# Altium schematic sheet VapeixS.SchDoc: Vapeix Shield 1.0
size A2; CheckedBy: q; DrawnBy: Anne Moller; Engineer: Anne Moller; DocumentNumber: 1; Revision: 1.0.0; SheetNumber: 1; SheetTotal: 1; Project Number: 1; DocumentName: Anne Moller; ProjectName: Vapeix Shield
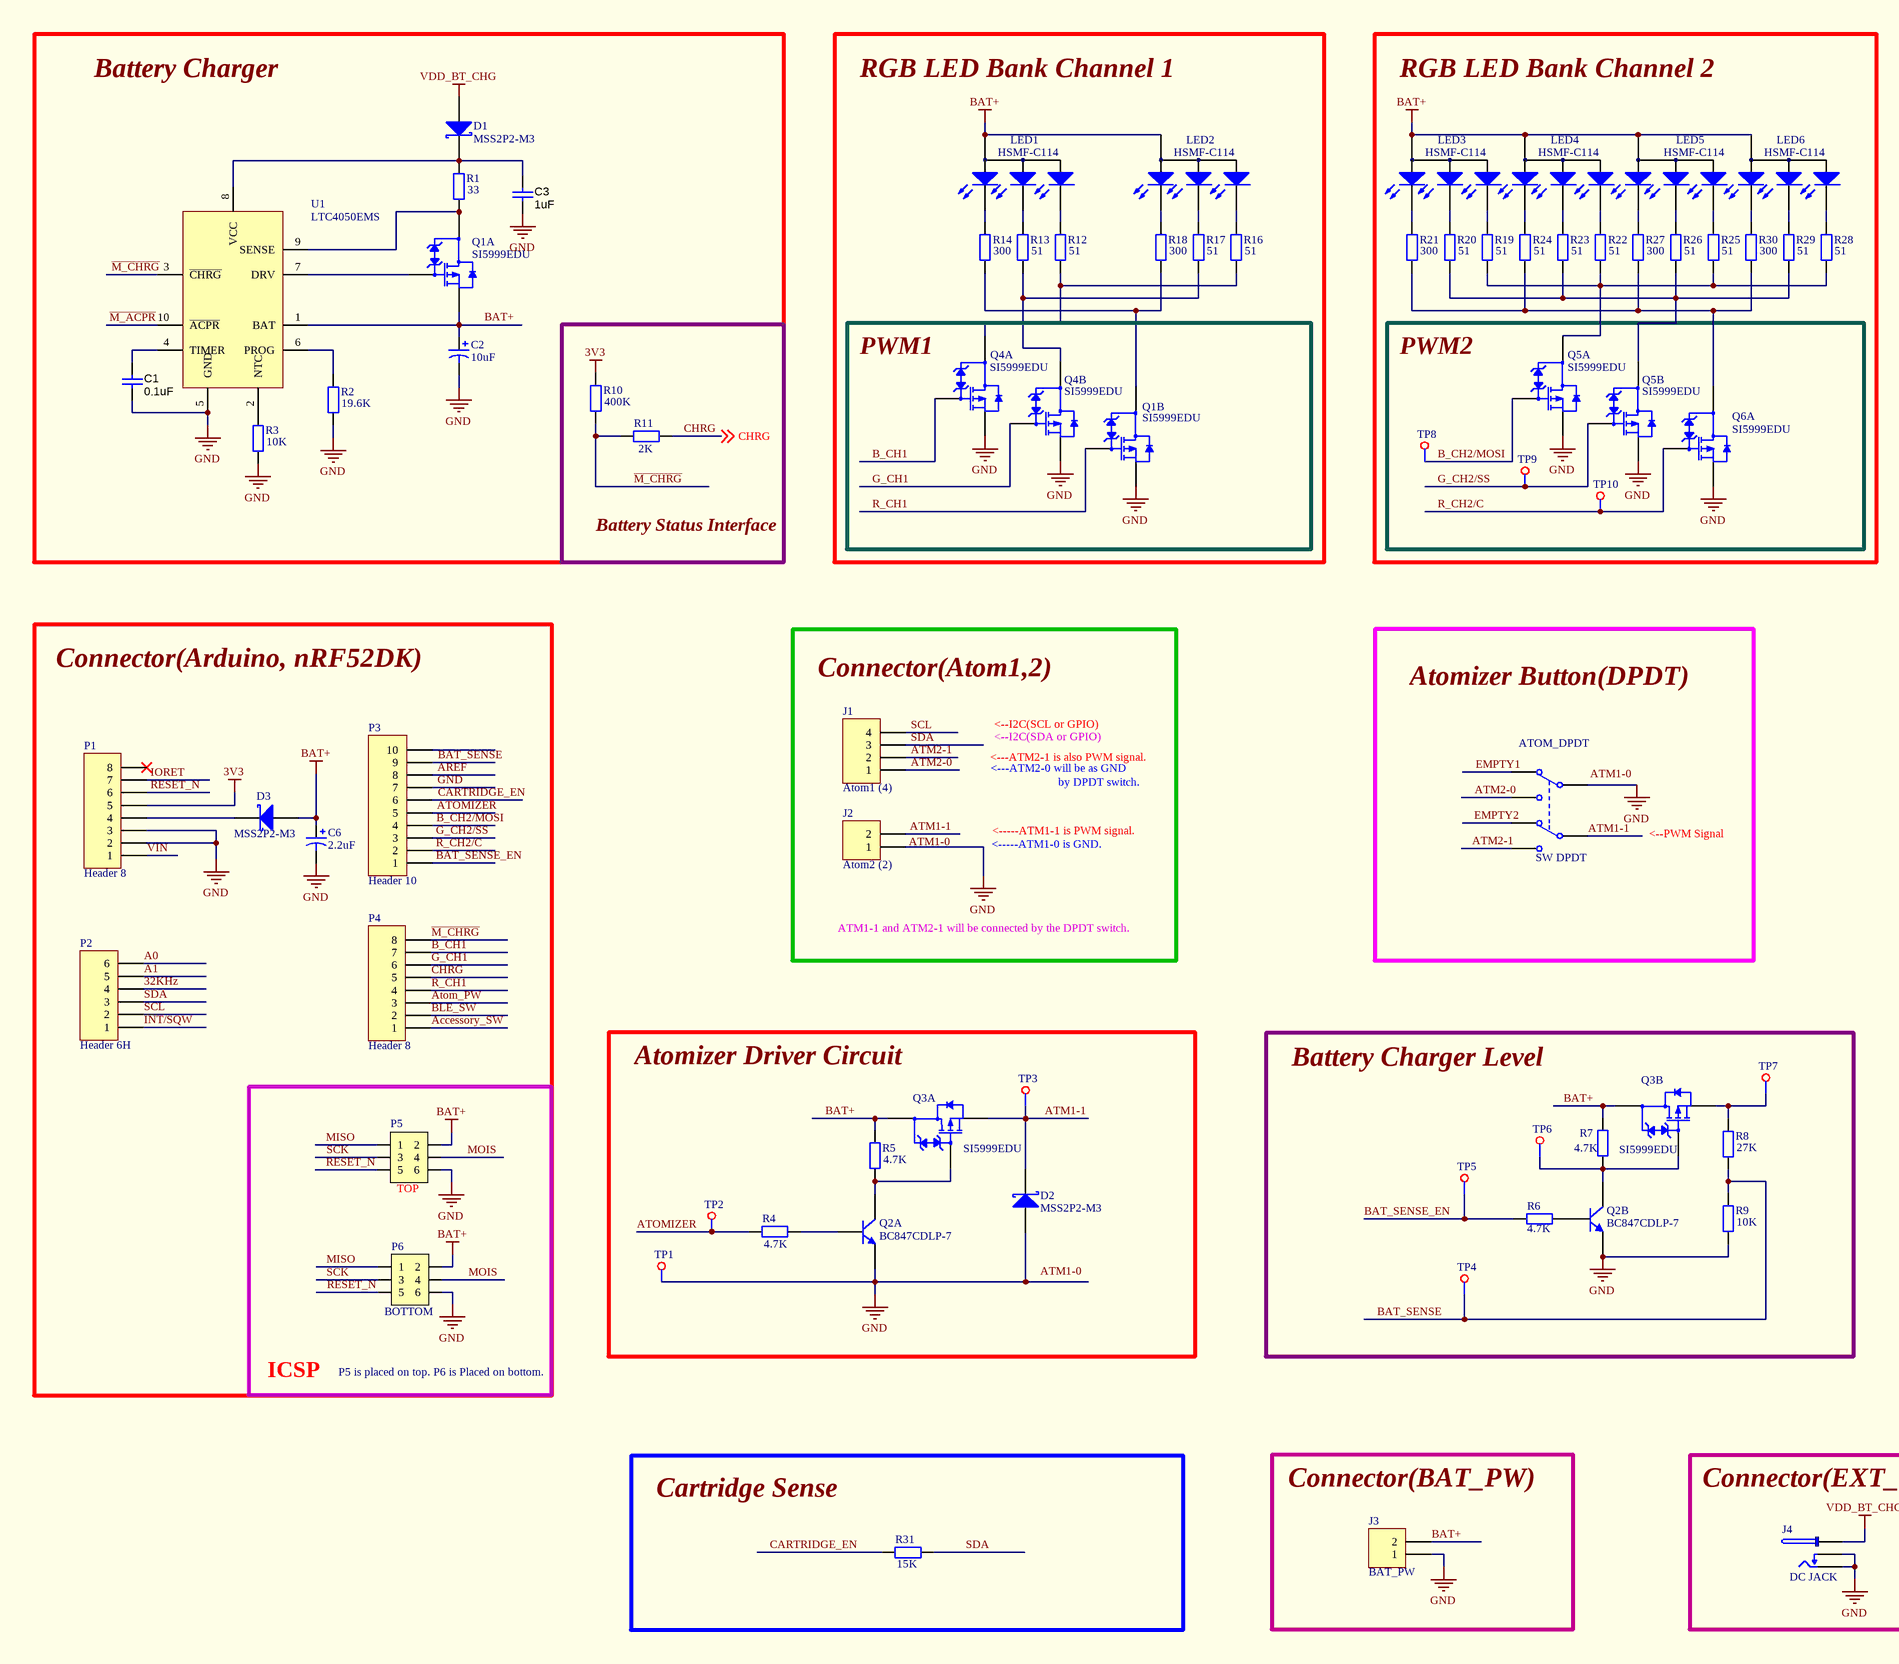
[diagram p0: VapeixS.SchDoc, left]
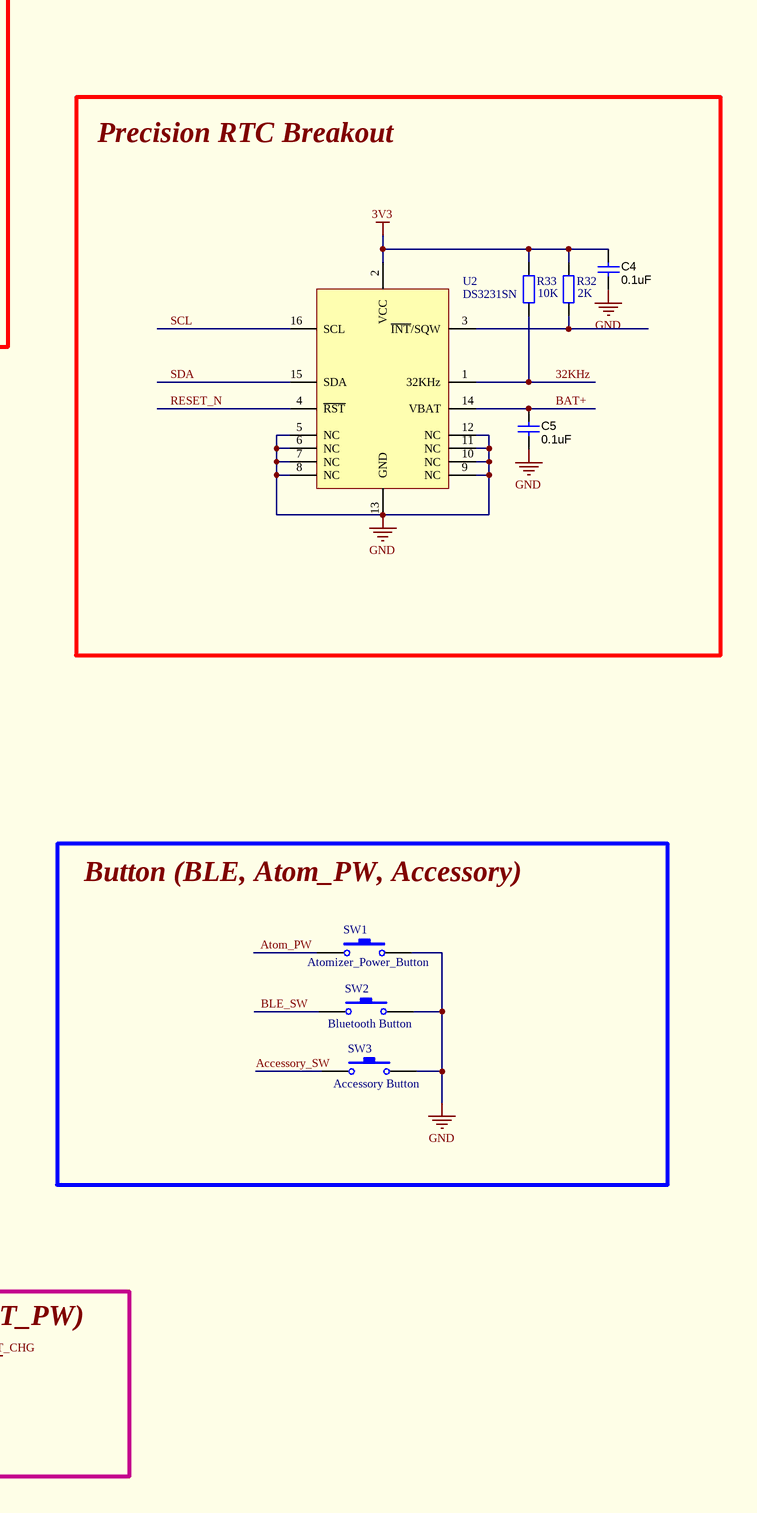
[diagram p1: VapeixS.SchDoc, right]

## Parts
ATOM_DPDT  SW DPDT  [JS202011SCQN]
C1  ValueDisplayed: 0.1uF  [CAPC1608X06L]
C2  value 10uF  [C0805]  (hidden comment: Cap Pol3)
C3  ValueDisplayed: 1uF  [CAPC1608X06L]
C4  ValueDisplayed: 0.1uF  [CAPC1608X06L]
C5  ValueDisplayed: 0.1uF  [CAPC1608X06L]
C6  value 2.2uF  [C0805]  (hidden comment: Cap Pol3)
D1  MSS2P2-M3  [MSS2P2-M3]
D2  MSS2P2-M3  [MSS2P2-M3]
D3  MSS2P2-M3  [MSS2P2-M3]
J1  Atom1 (4)  [S4B-PH-K-S]
J2  Atom2 (2)  [S2B-PH-K-S]
J3  BAT_PW  [S2B-PH-K-S]
J4  DC JACK  [DC POWER JACK]
LED1  HSMF-C114  [HSMF-C114]
LED2  HSMF-C114  [HSMF-C114]
LED3  HSMF-C114  [HSMF-C114]
LED4  HSMF-C114  [HSMF-C114]
LED5  HSMF-C114  [HSMF-C114]
LED6  HSMF-C114  [HSMF-C114]
P1  Header 8  [LS-00008]
P2  Header 6H  [LS-00007]
P3  Header 10  [LS-00009]
P4  Header 8  [LS-00008]
P5  TOP  [Molex 15-91-2060]
P6  BOTTOM  [CLH-103-F-D-BE-K-TR]
Q1  SI5999EDU  [SI5999EDU]  (parts A,B of 2)
Q2  BC847CDLP-7  [BC847CDLP-7]  (parts A,B of 2)
Q3  SI5999EDU  [SI5999EDU]  (parts A,B of 2)
Q4  SI5999EDU  [SI5999EDU]  (parts A,B of 2)
Q5  SI5999EDU  [SI5999EDU]  (parts A,B of 2)
Q6  SI5999EDU  [SI5999EDU]  (part A of 2)
R1  value 33  [INDC1608X06L]
R2  value 19.6K  [INDC1608X06L]
R3  value 10K  [INDC1608X06L]
R4  value 4.7K  [INDC1608X06L]
R5  value 4.7K  [INDC1608X06L]
R6  value 4.7K  [INDC1608X06L]
R7  value 4.7K  [INDC1608X06L]
R8  value 27K  [INDC1608X06L]
R9  value 10K  [INDC1608X06L]
R10  value 400K  [INDC1608X06L]
R11  value 2K  [INDC1608X06L]
R12  value 51  [INDC1608X06L]
R13  value 51  [INDC1608X06L]
R14  value 300  [INDC1608X06L]
R16  value 51  [INDC1608X06L]
R17  value 51  [INDC1608X06L]
R18  value 300  [INDC1608X06L]
R19  value 51  [INDC1608X06L]
R20  value 51  [INDC1608X06L]
R21  value 300  [INDC1608X06L]
R22  value 51  [INDC1608X06L]
R23  value 51  [INDC1608X06L]
R24  value 51  [INDC1608X06L]
R25  value 51  [INDC1608X06L]
R26  value 51  [INDC1608X06L]
R27  value 300  [INDC1608X06L]
R28  value 51  [INDC1608X06L]
R29  value 51  [INDC1608X06L]
R30  value 300  [INDC1608X06L]
R31  value 15K  [INDC1608X06L]
R32  value 2K  [INDC1608X06L]
R33  value 10K  [INDC1608X06L]
SW1  Atomizer_Power_Button  [PTS645SH50SMTR92]
SW2  Bluetooth Button  [PTS645SH50SMTR92]
SW3  Accessory Button  [PTS645SH50SMTR92]
TP1  TP  [TP]  (value not drawn)
TP2  TP  [TP]  (value not drawn)
TP3  TP  [TP]  (value not drawn)
TP4  TP  [TP]  (value not drawn)
TP5  TP  [TP]  (value not drawn)
TP6  TP  [TP]  (value not drawn)
TP7  TP  [TP]  (value not drawn)
TP8  TP  [TP]  (value not drawn)
TP9  TP  [TP]  (value not drawn)
TP10  TP  [TP]  (value not drawn)
U1  LTC4050EMS  [LTC4050EMS]
U2  DS3231SN  [DS3231SN]

## Nets
3V3: C4.1 P1.5 R10.1 R32.1 R33.1 U2.2(VCC)
BAT+: C2.1 C5.1 C6.1 D3.1(A) J3.2 LED1.1(ANODE) LED2.1(ANODE) LED3.1(ANODE) LED4.1(ANODE) LED5.1(ANODE) LED6.1(ANODE) P5.2 P6.2 Q1.7(D1) Q3.1(S1) Q3.3(S2) R5.1 R7.1 U1.1(BAT) U2.14(VBAT)
GND: ATOM_DPDT.2(COMMON1) C1.2 C2.2 C3.2 C4.2 C5.2 C6.2 D2.1(A) J2.1 J3.1 J4.2 J4.3 P1.2 P1.3 P3.7 P5.6 P6.6 Q1.5(D2) Q2.1(E1) Q2.4(E2) Q4.5(D2) Q4.7(D1) Q5.5(D2) Q5.7(D1) Q6.7(D1) R2.2 R3.2 R9.2 SW1.2 SW2.2 SW3.2 TP1.1(TP) U1.5(GND) U2.5(NC) U2.6(NC) U2.7(NC) U2.8(NC) U2.9(NC) U2.10(NC) U2.11(NC) U2.12(NC) U2.13(GND)
VDD_BT_CHG: D1.1(A) J4.1
32KHz: P2.4 R33.2 U2.1(32KHz)
A0: P2.6
A1: P2.5
Accessory_SW: P4.1 SW3.1
AREF: P3.8
ATM1-1: ATOM_DPDT.5(COMMON2) D2.2(K) J2.2 Q3.7(D1) TP3.1(TP)
ATM2-0: ATOM_DPDT.3(NO1) J1.1
ATM2-1: ATOM_DPDT.6(NO2) J1.2
Atom_PW: P4.3 SW1.1
ATOMIZER: P3.5 R4.1 TP2.1(TP)
B_CH1: P4.7 Q4.2(G1)
B_CH2/MOSI: P3.4 Q5.2(G1) TP8.1(TP)
BAT_SENSE: P3.9 R8.2 R9.1 TP4.1(TP)
BAT_SENSE_EN: P3.1 R6.1 TP5.1(TP)
BLE_SW: P4.2 SW2.1
CARTRIDGE_EN: P3.6 R31.1
CHRG: P4.5 R11.2 ; off-sheet CHRG
EMPTY1: ATOM_DPDT.1(NC1)
EMPTY2: ATOM_DPDT.4(NC2)
G_CH1: P4.6 Q4.4(G2)
G_CH2/SS: P3.3 Q5.4(G2) TP9.1(TP)
~{INT}/SQW: P2.1
IORET: P1.7
~{M_ACPR}: U1.10(~{ACPR})
~{M_CHRG}: P4.8 R10.2 R11.1 U1.3(~{CHRG})
MISO: P5.1 P6.1
MOIS: P5.4 P6.4
R_CH1: P4.4 Q1.4(G2)
R_CH2/C: P3.2 Q6.2(G1) TP10.1(TP)
RESET_N: P1.6 P5.5 P6.5 U2.4(~{RST})
SCK: P5.3 P6.3
SCL: J1.4 P2.2 U2.16(SCL)
SDA: J1.3 P2.3 R31.2 U2.15(SDA)
VIN: P1.1
NetC1_1: C1.1 U1.4(TIMER)
NetC3_1: C3.1 D1.2(K) R1.1 U1.8(VCC)
NetD3_2: D3.2(K) P1.4
NetLED1_2: LED1.2(RED) R14.1
NetLED1_3: LED1.3(GREEN) R13.1
NetLED1_4: LED1.4(BLUE) R12.1
NetLED2_2: LED2.2(RED) R18.1
NetLED2_3: LED2.3(GREEN) R17.1
NetLED2_4: LED2.4(BLUE) R16.1
NetLED3_2: LED3.2(RED) R21.1
NetLED3_3: LED3.3(GREEN) R20.1
NetLED3_4: LED3.4(BLUE) R19.1
NetLED4_2: LED4.2(RED) R24.1
NetLED4_3: LED4.3(GREEN) R23.1
NetLED4_4: LED4.4(BLUE) R22.1
NetLED5_2: LED5.2(RED) R27.1
NetLED5_3: LED5.3(GREEN) R26.1
NetLED5_4: LED5.4(BLUE) R25.1
NetLED6_2: LED6.2(RED) R30.1
NetLED6_3: LED6.3(GREEN) R29.1
NetLED6_4: LED6.4(BLUE) R28.1
NetQ1_1: Q1.1(S1) R1.2 U1.9(SENSE)
NetQ1_2: Q1.2(G1) U1.7(DRV)
NetQ1_3: Q1.3(S2) R14.2 R18.2
NetQ2_2: Q2.2(B1) R4.2
NetQ2_3: Q2.3(C1) Q3.2(G1) R5.2
NetQ2_5: Q2.5(B2) R6.2
NetQ2_6: Q2.6(C2) Q3.4(G2) R7.2 TP6.1(TP)
NetQ3_5: Q3.5(D2) R8.1 TP7.1(TP)
NetQ4_1: Q4.1(S1) R12.2 R16.2
NetQ4_3: Q4.3(S2) R13.2 R17.2
NetQ5_1: Q5.1(S1) R19.2 R22.2 R25.2 R28.2
NetQ5_3: Q5.3(S2) R20.2 R23.2 R26.2 R29.2
NetQ6_1: Q6.1(S1) R21.2 R24.2 R27.2 R30.2
NetR2_1: R2.1 U1.6(PROG)
NetR3_1: R3.1 U1.2(NTC)
NetR32_2: R32.2 U2.3(~{INT}/SQW)

Not connected (* = marked no-connect by the designer): P1 8*; P3 10

## Notes on the sheet
- Labels drawn without touching a wire or pin: <-----ATM1-0 is GND., <-----ATM1-1 is PWM signal., <---ATM2-0 will be as GND, <---ATM2-1 is also PWM signal., <--I2C(SCL or GPIO), <--I2C(SDA or GPIO), <--PWM Signal, ATM1-0, ATM1-1 and ATM2-1 will be connected by the DPDT switch., Atomizer Button(DPDT), Atomizer Driver Circuit, Battery Charger, Battery Charger Level, Battery Status Interface, Button (BLE, Atom_PW, Accessory), by DPDT switch., Cartridge Sense, Connector(Arduino, nRF52DK), Connector(Atom1,2), Connector(BAT_PW), Connector(EXT_PW), ICSP, P5 is placed on top. P6 is Placed on bottom., Precision RTC Breakout, PWM1, PWM2, RGB LED Bank Channel 1, RGB LED Bank Channel 2
- Title
- Date:
- File:
- Size
- A2
- Project Number
- Sheet
- Drawn by :
- Revision
- of

## Library data of the parts
ATOM_DPDT = JS202011SCQN: SWITCH SLIDE DPDT 300MA 6V; Manufacturer: C&K Components; Contact Timing: Not Specified; Switch Function: On-On; Current Rating: 300mA (DC); Actuator Type: Standard; Actuator Length: 2.00mm; Actuator Material: Polyamide (PA46), Nylon 4/6; Electrical Life: 5,000 Cycles; Supplier 1: Digi-Key; Manufacturer Part Number: JS202011SCQN; RoHS: RoHS Compliant; Category: Switches; Stock 1: 26140; Pricing 1: 1=0.46, 10=0.441, 25=0.4316, 50=0.3858, 100=0.3674, 250=0.3582, 500=0.3031 (USD); Packaging: Cut Tape (CT); Circuit: DPDT; Voltage Rating - AC: -; Voltage Rating - DC: 6V; Contact Material: Copper Alloy; Contact Finish: Silver; Mounting Type: Surface Mount; Termination Style: Gull Wing; Features: -; Switch Travel: 2.00mm; Operating Temperature: -40°C ~ 85°C; Mechanical Life: -; Operating Force: -; ComponentLink1URL: http://www.ck-components.com/14398/js_7jan16.pdf/; ComponentLink1Description: http://www.ck-components.com/14398/js_7jan16.pdf/
C1 C3-C5 = GRM219R61A106KE44D: CAP, CERM, 10 µF, 10 V, +/- 10%, X5R, 0805; Manufacturer: MuRata; Polarized: N; CompType: Capacitor; Value: 10uF; U/M: EA; Cap_F: 0.00001; Tolerance_%: 10; ESR_ohm: 0.005; Value1: 0.005 ohm; Value2: 10V; TaMin_C: -55; TaMax_C: 85; Cap_Case: 0805; SymbolVersion: 2008-07-09; PartNumber: GRM219R61A106KE44D; PackageReference: 0805; RoHS: Y; VDC_V: 10; MountType: SMT; Technology: Ceramic; TempCo: X5R; Published: 2008-06-19; Publisher: Texas Instruments; LatestRevisionDate: 2014-08-19; ComponentLink1Description: Datasheet link; ComponentLink1URL: http://psearch.murata.com/capacitor/product/GRM219R61A106KE44%23.pdf; Supplier 1: Digi-Key; Supplier Part Number 1: 490-4735-1-ND; Supplier 2: Mouser; Supplier Part Number 2: 81-GRM219R61A106KE4D; Supplier 3: Farnell; Supplier Part Number 3: 1845741
C2 C6 = Cap Pol3: Polarized Capacitor (Surface Mount); Published: 8-Jun-2000; LatestRevisionDate: 29-May-2009; LatestRevisionNote: IPC-7351 Footprint Added.; PackageReference: C0805; Publisher: Altium Limited; PackageDescription: Chip Capacitor
D1-D3 = MSS2P2-M3/89A: DIODE SCHOTTKY 20V 2A MICROSMP; Manufacturer: Vishay Semiconductor Diodes Division; Voltage - Forward (Vf) (Max) @ If: 600mV @ 2A; Speed: Fast Recovery =< 500ns, > 200mA (Io); Current - Reverse Leakage @ Vr: 250µA @ 20V; Capacitance @ Vr, F: 65pF @ 4V, 1MHz; Supplier 1: Digi-Key; Manufacturer Part Number: MSS2P2-M3/89A; RoHS: RoHS Compliant; Category: Discrete Semiconductor Products; Stock 1: 3961; Pricing 1: 1=0.37, 10=0.274, 100=0.1552, 500=0.1029, 1000=0.07892 (USD); Packaging: Digi-Reel®; Diode Type: Schottky; Voltage - DC Reverse (Vr) (Max): 20V; Current - Average Rectified (Io): 2A; Reverse Recovery Time (trr): -; Mounting Type: Surface Mount; Package / Case: MicroSMP; Supplier Device Package: MicroSMP; Operating Temperature - Junction: -55°C ~ 150°C; ComponentLink1URL: http://www.vishay.com/docs/89054/mss2p3.pdf; ComponentLink1Description: http://www.vishay.com/docs/89054/mss2p3.pdf
J1 = S4B-PH-K-S(LF)(SN): CONN HEADER PH SIDE 4POS 2MM; Manufacturer: JST Sales America Inc.; Connector Type: Header, Shrouded; Number of Positions: 4; Number of Positions Loaded: All; Pitch: 0.079" (2.00mm); Supplier 1: Digi-Key; Manufacturer Part Number: S4B-PH-K-S(LF)(SN); RoHS: RoHS Compliant; Category: Connectors, Interconnects; Stock 1: 41576; Pricing 1: 1=0.22, 10=0.208, 25=0.1772, 50=0.155, 100=0.144, 250=0.1274, 500=0.12186, 1000=0.0997, 2500=0.09139 (USD); Packaging: Bulk; Contact Type: Male Pin; Number of Rows: 1; Row Spacing: -; Contact Mating Length: 0.130" (3.30mm); Mounting Type: Through Hole, Right Angle; Termination: Press-Fit, Solder; Fastening Type: Detent Lock; Features: -; Contact Finish: Tin; Contact Finish Thickness: -; Color: Natural; ComponentLink1URL: http://www.jst-mfg.com/product/pdf/eng/ePH.pdf; ComponentLink1Description: http://www.jst-mfg.com/product/pdf/eng/ePH.pdf
J2 J3 = S2B-PH-K-S(LF)(SN): CONN HEADER PH SIDE 2POS 2MM; Manufacturer: JST Sales America Inc.; Connector Type: Header, Shrouded; Number of Positions: 2; Number of Positions Loaded: All; Pitch: 0.079" (2.00mm); Supplier 1: Digi-Key; Manufacturer Part Number: S2B-PH-K-S(LF)(SN); RoHS: RoHS Compliant; Category: Connectors, Interconnects; Stock 1: 71254; Pricing 1: 1=0.17, 10=0.161, 25=0.1196, 50=0.1026, 100=0.0991, 250=0.08544, 500=0.08202, 1000=0.07177, 2500=0.06494 (USD); Packaging: Bulk; Contact Type: Male Pin; Number of Rows: 1; Row Spacing: -; Contact Mating Length: 0.130" (3.30mm); Mounting Type: Through Hole, Right Angle; Termination: Press-Fit, Solder; Fastening Type: Detent Lock; Features: -; Contact Finish: Tin; Contact Finish Thickness: -; Color: Natural; ComponentLink1URL: http://www.jst-mfg.com/product/pdf/eng/ePH.pdf; ComponentLink1Description: http://www.jst-mfg.com/product/pdf/eng/ePH.pdf
J4 = DC POWER JACK: Adafruit Accessories 2.1mm DC Barrel Jack Breadboard Friendly; Manufacturer Part Number: 373; Supplier 1: Mouser; Manufacturer: Adafruit; RoHS: RoHS Compliant; Category: Adafruit Accessories; Stock 1: 0; Pricing 1: 1=0.950, 10=0.860 (USD); Product: Connectors; Type: DC Power Connectors; Brand: Adafruit; RoHS - Mouser: Y; Minimum Order Quantity: 1; Reeling: False
LED1-LED6 = HSMF-C114: LED RGB DIFFUSED 0606 SMD; Manufacturer: Broadcom Limited; Color: Red, Green, Blue (RGB); Lens Color: White; Millicandela Rating: 85mcd Red, 180mcd Green, 70mcd Blue; Lens Style/Size: Rectangle with Flat Top, 1.10mm x 1.50mm; Voltage - Forward (Vf) (Typ): 1.9V Red, 3.4V Green, 3.4V Blue; Current - Test: 20mA Red, 20mA Green, 20mA Blue; Viewing Angle: 140° Red, 145° Green, 145° Blue; Wavelength - Dominant: 626nm Red, 525nm Green, 470nm Blue; Wavelength - Peak: 637nm Red, 523nm Green, 468nm Blue; Supplier 1: Digi-Key; Manufacturer Part Number: HSMF-C114; RoHS: RoHS Compliant; Category: Optoelectronics; Stock 1: 11787; Pricing 1: 1=2.03, 10=1.62, 25=1.2376, 100=1.125, 250=0.99, 500=0.8325, 1000=0.72 (USD); Packaging: Digi-Reel®; Lens Transparency: Diffused; Mounting Type: Surface Mount; Features: -; Package / Case: 0606 (1616 Metric); Supplier Device Package: Chip LED; Size / Dimension: 1.60mm L x 1.50mm W; Height (Max): 0.35mm; ComponentLink1URL: http://www.avagotech.com/docs/AV02-2451EN; ComponentLink1Description: http://www.avagotech.com/docs/AV02-2451EN
P1 P4 = LS-00008: Arduino Femal e Stackable Headers - 8 pin (4 pack); Manufacturer: OSEPP; Supplier 1: Allied; Manufacturer Part Number: LS-00008; RoHS: No; Stock 1: 3; Pricing 1: 1=1.7500, 10=1.5700, 25=1.4000 (USD); ComponentLink1URL: http:; ComponentLink1Description: http:; ComponentLink2URL: http://www.alliedelec.com/osepp-ls-00008/70662541/; ComponentLink2Description: http://www.alliedelec.com/osepp-ls-00008/70662541/
P2 = Header 6H: Header, 6-Pin, Right Angle; LatestRevisionDate: 17-Jul-2002; LatestRevisionNote: Re-released for DXP Platform.; Publisher: Altium Limited
P3 = LS-00009: Arduino Female Stackable Header - 10 pin (4 pack); Manufacturer: OSEPP; Supplier 1: Allied; Manufacturer Part Number: LS-00009; RoHS: No; Stock 1: 150; Pricing 1: 1=1.7500, 10=1.5700, 25=1.4000 (USD); ComponentLink1URL: http:; ComponentLink1Description: http:; ComponentLink2URL: http://www.alliedelec.com/osepp-ls-00009/70662542/; ComponentLink2Description: http://www.alliedelec.com/osepp-ls-00009/70662542/
P5 = 0015912060: CONN HEADER 6POS .100" VERT TIN; Manufacturer: Molex, LLC; Connector Type: Header, Unshrouded, Breakaway; Number of Positions: 6; Number of Positions Loaded: All; Pitch: 0.100" (2.54mm); Supplier 1: Digi-Key; Manufacturer Part Number: 0015912060; RoHS: RoHS Compliant; Category: Connectors, Interconnects; Stock 1: 10294; Pricing 1: 1=0.43, 10=0.4, 25=0.36, 50=0.32, 100=0.3066, 250=0.27992, 500=0.2666, 1000=0.21995, 2500=0.19995 (USD); Packaging: Bulk; Contact Type: Male Pin; Number of Rows: 2; Row Spacing: 0.100" (2.54mm); Contact Mating Length: 0.240" (6.10mm); Mounting Type: Surface Mount; Termination: Solder; Fastening Type: -; Features: -; Contact Finish: Tin; Contact Finish Thickness: 150µin (3.81µm); Color: Black; ComponentLink1URL: http://www.molex.com/pdm_docs/sd/015912060_sd.pdf; ComponentLink1Description: http://www.molex.com/pdm_docs/sd/015912060_sd.pdf
P6 = M20-7870346: Headers & Wire Housings 03+03 DIL SMT SKT BOTTOM ENTRY TIN; Manufacturer: Harwin; Number of Positions: 6 Position; Pitch: 2.54 mm; Supplier 1: Mouser; Manufacturer Part Number: M20-7870346; RoHS: RoHS Compliant; Category: Headers & Wire Housings; Stock 1: 507; Pricing 1: 1=0.730, 10=0.584, 100=0.508, 500=0.457, 1000=0.406, 2500=0.368, 5000=0.356, 10000=0.338, 25000=0.325 (USD); Number of Rows: 2 Row; Packaging: Tube; Product: Headers; Series: M20; Termination Style: SMD; Type: Socket Assembly; Brand: Harwin; Mounting Style: -; Product Category: 2.54mm M20 SMT Connectors; Standard Pack Qty: 73; RoHS - Mouser: Y; Minimum Order Quantity: 1; Reeling: False; ComponentLink1URL: http://www.mouser.com/ds/2/181/M20-787-350754.pdf; ComponentLink1Description: http://www.mouser.com/ds/2/181/M20-787-350754.pdf
Q1 Q3-Q6 = SI5999EDU-T1-GE3: MOSFET 2P-CH 20V 6A POWERPAK; Manufacturer: Vishay Siliconix; FET Type: 2 P-Channel (Dual); FET Feature: Logic Level Gate; Rds On (Max) @ Id, Vgs: 59 mOhm @ 3.5A, 4.5V; Vgs(th) (Max) @ Id: 1.5V @ 250µA; Gate Charge (Qg) @ Vgs: 20nC @ 10V; Input Capacitance (Ciss) @ Vds: 496pF @ 10V; Power - Max: 10.4W; Supplier 1: Digi-Key; Manufacturer Part Number: SI5999EDU-T1-GE3; RoHS: RoHS Compliant; Category: Discrete Semiconductor Products; Stock 1: 2994; Pricing 1: 1=0.58, 10=0.51, 100=0.39, 500=0.309, 1000=0.2475 (USD); Packaging: Cut Tape (CT); Drain to Source Voltage (Vdss): 20V; Current - Continuous Drain (Id) @ 25°C: 6A; Operating Temperature: -55°C ~ 150°C (TJ); Mounting Type: Surface Mount; Package / Case: PowerPAK® ChipFET™ Dual; Supplier Device Package: PowerPAK® ChipFet Dual; ComponentLink1URL: http://www.vishay.com/docs/67019/si5999ed.pdf; ComponentLink1Description: http://www.vishay.com/docs/67019/si5999ed.pdf
Q2 = BC847CDLP-7: TRANS 2NPN 45V 0.1A 6DFN; Manufacturer: Diodes Incorporated; Transistor Type: 2 NPN (Dual); Current - Collector (Ic) (Max): 100mA; Vce Saturation (Max) @ Ib, Ic: 600mV @ 5mA, 100mA; Current - Collector Cutoff (Max): 15nA; DC Current Gain (hFE) (Min) @ Ic, Vce: 420 @ 2mA, 5V; Power - Max: 350mW; Frequency - Transition: 100MHz; Supplier 1: Digi-Key; Manufacturer Part Number: BC847CDLP-7; RoHS: RoHS Compliant; Category: Discrete Semiconductor Products; Stock 1: 11845; Pricing 1: 1=0.36, 10=0.29, 100=0.198, 500=0.1482, 1000=0.111 (USD); Packaging: Cut Tape (CT); Voltage - Collector Emitter Breakdown (Max): 45V; Mounting Type: Surface Mount; Package / Case: 6-SMD, No Lead; Supplier Device Package: 6-DFN1310H4 (1.0x1.3); ComponentLink1URL: http://www.diodes.com/_files/datasheets/ds30817.pdf; ComponentLink1Description: http://www.diodes.com/_files/datasheets/ds30817.pdf
R1-R14 R16-R33 = Res2: Resistor; Published: 8-Jun-2000; LatestRevisionDate: 17-Jul-2002; LatestRevisionNote: Re-released for DXP Platform.; PackageReference: R0603; Publisher: Altium Limited; PackageDescription: Axial Device, Thru-Hole; 2 Leads; 0.4 in Pin Spacing
SW1-SW3 = PTS645SH50SMTR92 LFS: SWITCH TACTILE SPST-NO 0.05A 12V; Manufacturer: C&K Components; Switch Function: Off-Mom; Contact Rating @ Voltage: 0.05A @ 12VDC; Actuator Type: Standard; Actuator Height off PCB, from Pins: 5.00mm; Actuator Orientation: Top Actuated; Outline: 6.00mm x 6.00mm; Illumination: Non-Illuminated; Operating Force: 200gf; Actuator Material: Polyamide (PA66), Nylon 6/6; Mechanical Life: 100,000 Cycles; Supplier 1: Digi-Key; Manufacturer Part Number: PTS645SH50SMTR92 LFS; RoHS: RoHS Compliant; Category: Switches; Stock 1: 54599; Pricing 1: 1=0.29, 10=0.281, 25=0.2712, 50=0.2614, 100=0.2468, 250=0.23232, 500=0.22264 (USD); Packaging: Digi-Reel®; Circuit: SPST-NO; Mounting Type: Surface Mount; Termination Style: Gull Wing; Illumination Voltage (Nominal): -; Illumination Type, Color: -; Ingress Protection: -; Features: -; Switch Travel: -; Operating Temperature: -20°C ~ 60°C; ComponentLink1URL: http://www.ck-components.com/14409/pts645_7jan16.pdf/; ComponentLink1Description: http://www.ck-components.com/14409/pts645_7jan16.pdf/
TP1-TP10 = TP: TEST POINT
U1 = LTC4050EMS-4.1#PBF: IC BATT CHRG CNTRL LI-ION 10MSOP; Manufacturer: Linear Technology; Function: Charge Management; Voltage - Supply: 4.5 V ~ 10 V; Supplier 1: Digi-Key; Manufacturer Part Number: LTC4050EMS-4.1#PBF; RoHS: RoHS Compliant; Category: Integrated Circuits (ICs); Stock 1: 1327; Pricing 1: 1=4.77, 25=3.1696, 100=2.3869 (USD); Packaging: Tube; Battery Chemistry: Li-Ion; Operating Temperature: -40°C ~ 85°C; Mounting Type: Surface Mount; Package / Case: 10-TFSOP, 10-MSOP (0.118", 3.00mm Width); Supplier Device Package: 10-MSOP; ComponentLink1URL: http://www.linear.com/docs/3321; ComponentLink1Description: http://www.linear.com/docs/3321
U2 = DS3231SN#T&R: IC RTC CLK/CALENDAR I2C 16-SOIC; Manufacturer: Maxim Integrated; Time Format: HH:MM:SS (12/24 hr); Date Format: YY-MM-DD-dd; Interface: I²C, 2-Wire Serial; Voltage - Supply: 2.3 V ~ 5.5 V; Current - Timekeeping (Max): 110µA ~ 170µA @ 3.63V ~ 5.5V; Supplier 1: Digi-Key; Manufacturer Part Number: DS3231SN#T&R; RoHS: RoHS Compliant; Category: Integrated Circuits (ICs); Stock 1: 4351; Pricing 1: 1=9.97, 10=9.41, 25=7.5276, 50=7.1512, 100=6.5867, 250=6.24792, 500=6.02208 (USD); Packaging: Cut Tape (CT); Type: Clock/Calendar; Features: Alarm, Leap Year, Square Wave Output, TCXO/Crystal; Memory Size: -; Voltage - Supply, Battery: 2.3 V ~ 5.5 V; Operating Temperature: -40°C ~ 85°C; Mounting Type: Surface Mount; Package / Case: 16-SOIC (0.295", 7.50mm Width); Supplier Device Package: 16-SOIC; ComponentLink1URL: http://datasheets.maximintegrated.com/en/ds/DS3231-DS3231S.pdf; ComponentLink1Description: http://datasheets.maximintegrated.com/en/ds/DS3231-DS3231S.pdf